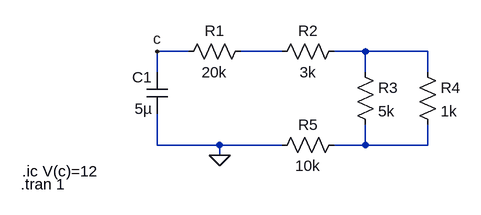
[diagram p0: schematic 8-22.asc]
8-22.asc, the LTspice schematic file:
Version 4
SHEET 1 880 680
WIRE 160 96 112 96
WIRE 304 96 240 96
WIRE 432 96 384 96
WIRE 528 96 432 96
WIRE 112 128 112 96
WIRE 432 128 432 96
WIRE 528 128 528 96
WIRE 112 240 112 192
WIRE 208 240 112 240
WIRE 304 240 208 240
WIRE 432 240 432 208
WIRE 432 240 384 240
WIRE 528 240 528 208
WIRE 528 240 432 240
WIRE 208 256 208 240
FLAG 208 256 0
FLAG 112 96 c
SYMBOL cap 128 128 M0
SYMATTR InstName C1
SYMATTR Value 5µ
SYMBOL res 256 80 R90
WINDOW 0 0 56 VBottom 2
WINDOW 3 32 56 VTop 2
SYMATTR InstName R1
SYMATTR Value 20k
SYMBOL res 400 80 R90
WINDOW 0 0 56 VBottom 2
WINDOW 3 32 56 VTop 2
SYMATTR InstName R2
SYMATTR Value 3k
SYMBOL res 416 112 R0
SYMATTR InstName R3
SYMATTR Value 5k
SYMBOL res 512 112 R0
SYMATTR InstName R4
SYMATTR Value 1k
SYMBOL res 400 224 R90
WINDOW 0 0 56 VBottom 2
WINDOW 3 32 56 VTop 2
SYMATTR InstName R5
SYMATTR Value 10k
TEXT -96 280 Left 2 !.ic V(c)=12
TEXT -98 300 Left 2 !.tran 1

The netlist it stands for:
* 8-22.asc
C1 c 0 5µ
R1 N001 c 20k
R2 N002 N001 3k
R3 N002 N003 5k
R4 N002 N003 1k
R5 N003 0 10k
.ic V(c)=12
.tran 1
.backanno
.end